# Altium schematic sheet Relays.SchDoc
size A3 portrait
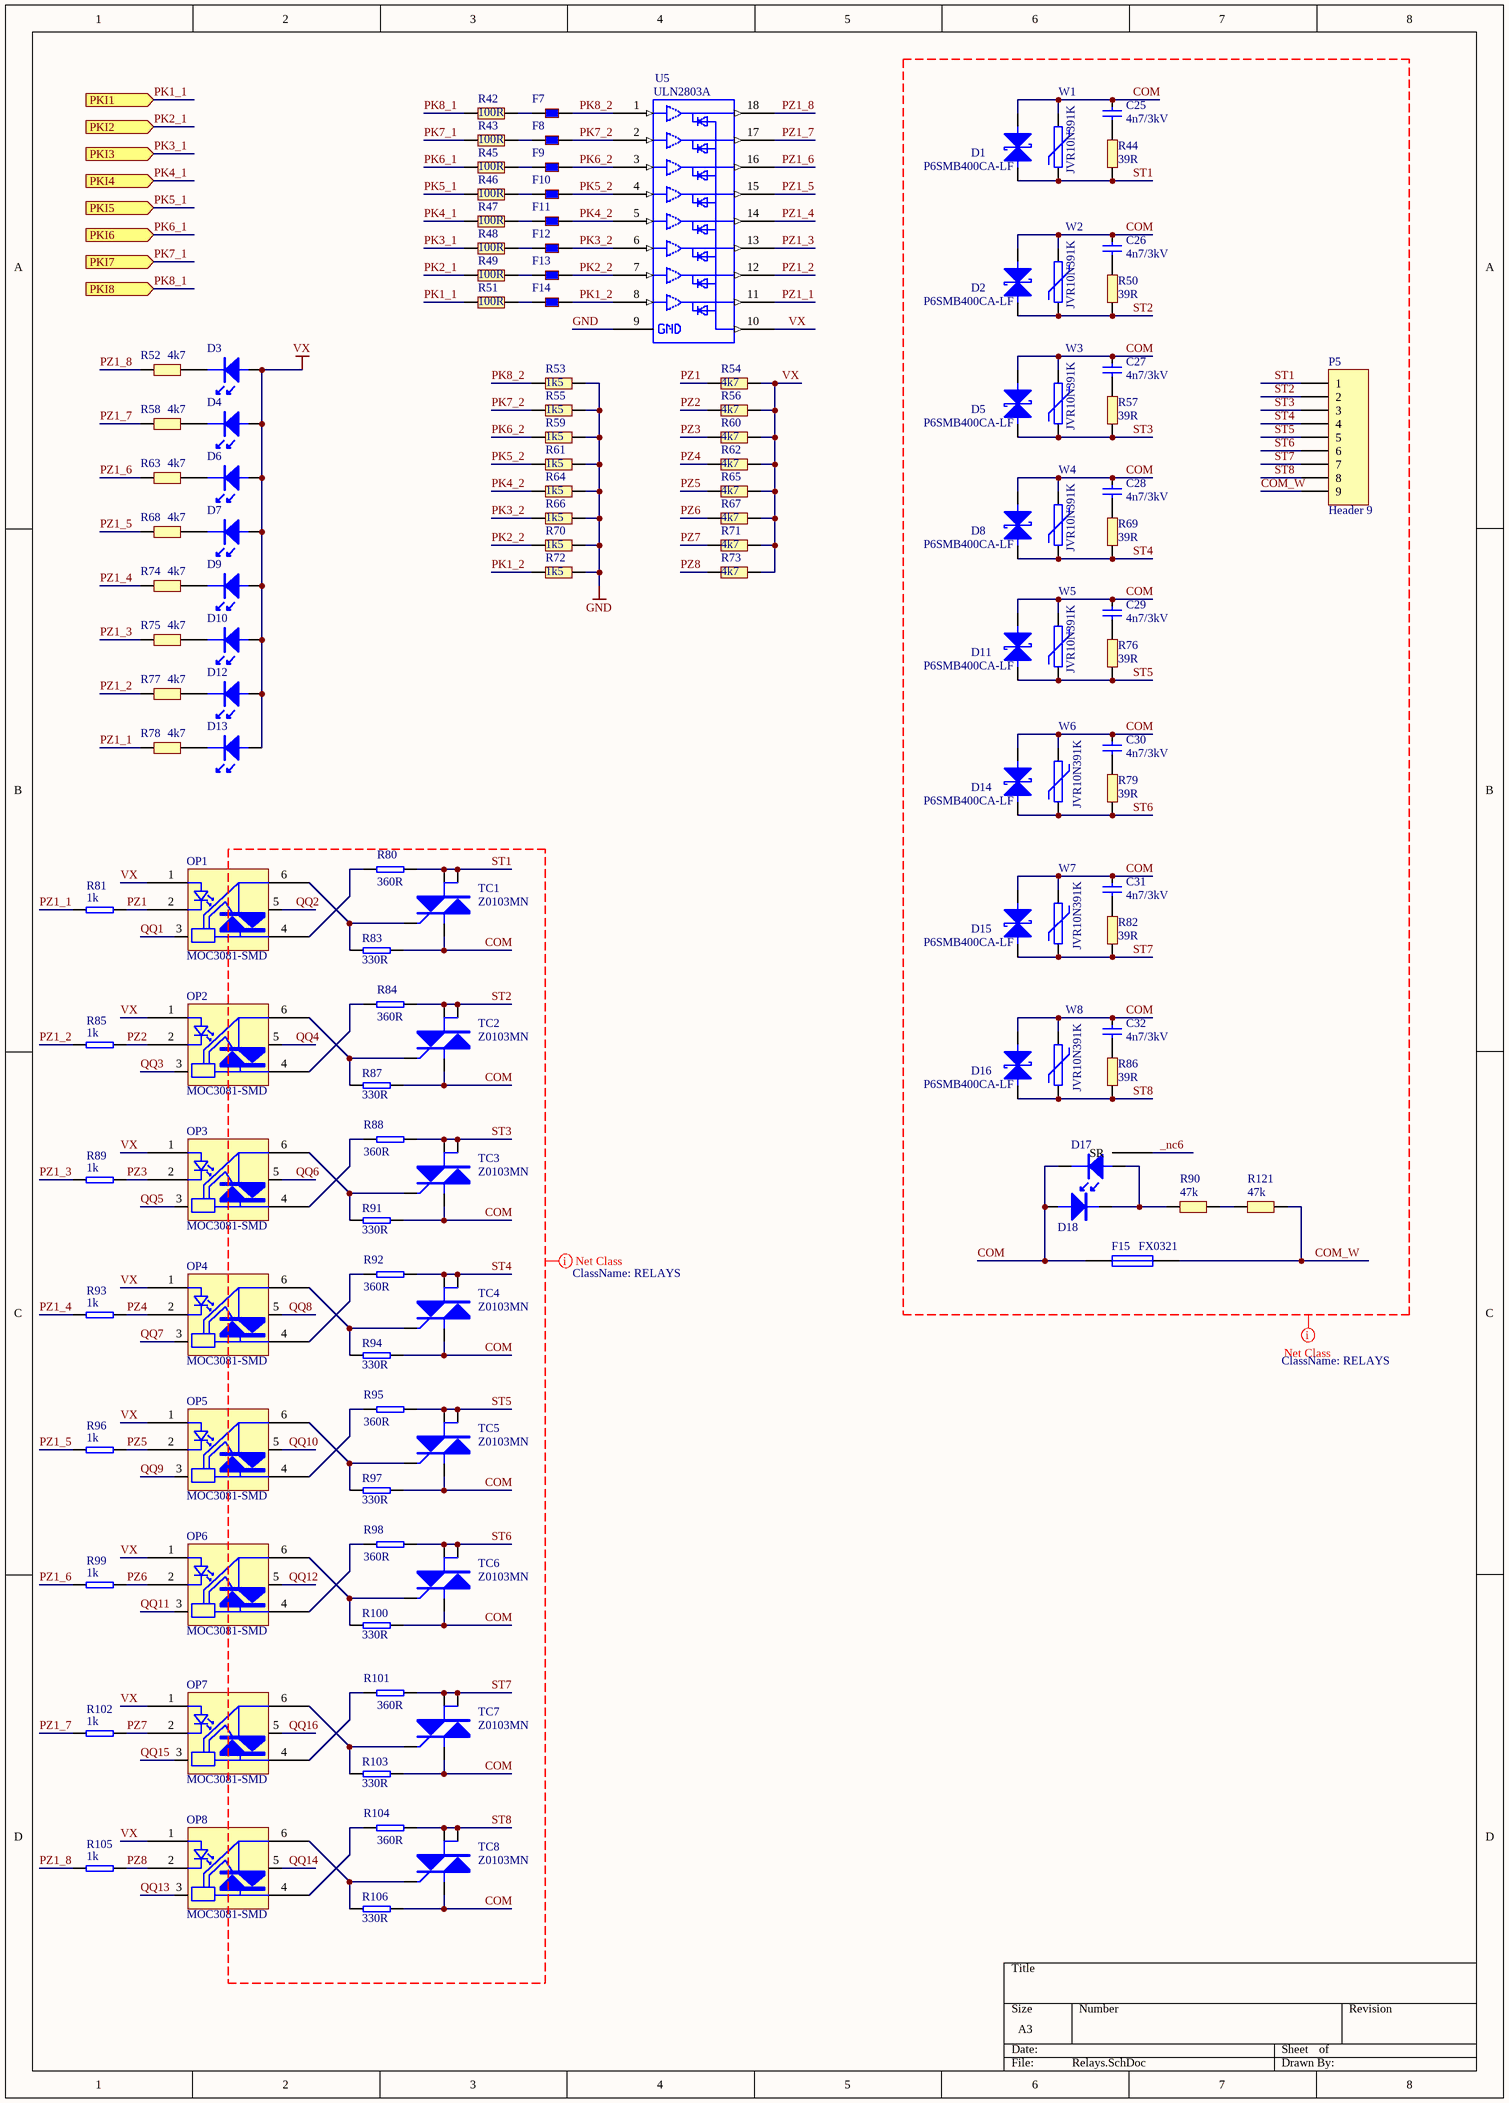
[diagram p0: Relays.SchDoc]

## Parts
C25  4n7/3kV  [CAP_75]
C26  4n7/3kV  [CAP_75]
C27  4n7/3kV  [CAP_75]
C28  4n7/3kV  [CAP_75]
C29  4n7/3kV  [CAP_75]
C30  4n7/3kV  [CAP_75]
C31  4n7/3kV  [CAP_75]
C32  4n7/3kV  [CAP_75]
D1  P6SMB400CA-LF  [RD5_U]
D2  P6SMB400CA-LF  [RD5_U]
D3  LED1  [0805LB]  (value not drawn)
D4  LED1  [0805LB]  (value not drawn)
D5  P6SMB400CA-LF  [RD5_U]
D6  LED1  [0805LB]  (value not drawn)
D7  LED1  [0805LB]  (value not drawn)
D8  P6SMB400CA-LF  [RD5_U]
D9  LED1  [0805LB]  (value not drawn)
D10  LED1  [0805LB]  (value not drawn)
D11  P6SMB400CA-LF  [RD5_U]
D12  LED1  [0805LB]  (value not drawn)
D13  LED1  [0805LB]  (value not drawn)
D14  P6SMB400CA-LF  [RD5_U]
D15  P6SMB400CA-LF  [RD5_U]
D16  P6SMB400CA-LF  [RD5_U]
D17  LED1  [LED_LAMP_1]  (value not drawn)
D18  1N4148-0805  [0805D]  (value not drawn)
F7  BLM18AG102SN1D  [0603L]  (value not drawn)
F8  BLM18AG102SN1D  [0603L]  (value not drawn)
F9  BLM18AG102SN1D  [0603L]  (value not drawn)
F10  BLM18AG102SN1D  [0603L]  (value not drawn)
F11  BLM18AG102SN1D  [0603L]  (value not drawn)
F12  BLM18AG102SN1D  [0603L]  (value not drawn)
F13  BLM18AG102SN1D  [0603L]  (value not drawn)
F14  BLM18AG102SN1D  [0603L]  (value not drawn)
F15  FX0321  [FX300]
OP1  MOC3081-SMD  [SMD6-OP]
OP2  MOC3081-SMD  [SMD6-OP]
OP3  MOC3081-SMD  [SMD6-OP]
OP4  MOC3081-SMD  [SMD6-OP]
OP5  MOC3081-SMD  [SMD6-OP]
OP6  MOC3081-SMD  [SMD6-OP]
OP7  MOC3081-SMD  [SMD6-OP]
OP8  MOC3081-SMD  [SMD6-OP]
P5  Header 9  [ARC-9-5.08]
R42  100R  [0603R]
R43  100R  [0603R]
R44  39R  [1206]
R45  100R  [0603R]
R46  100R  [0603R]
R47  100R  [0603R]
R48  100R  [0603R]
R49  100R  [0603R]
R50  39R  [1206]
R51  100R  [0603R]
R52  4k7  [0603R]
R53  1k5  [0603R]
R54  4k7  [0603R]
R55  1k5  [0603R]
R56  4k7  [0603R]
R57  39R  [1206]
R58  4k7  [0603R]
R59  1k5  [0603R]
R60  4k7  [0603R]
R61  1k5  [0603R]
R62  4k7  [0603R]
R63  4k7  [0603R]
R64  1k5  [0603R]
R65  4k7  [0603R]
R66  1k5  [0603R]
R67  4k7  [0603R]
R68  4k7  [0603R]
R69  39R  [1206]
R70  1k5  [0603R]
R71  4k7  [0603R]
R72  1k5  [0603R]
R73  4k7  [0603R]
R74  4k7  [0603R]
R75  4k7  [0603R]
R76  39R  [1206]
R77  4k7  [0603R]
R78  4k7  [0603R]
R79  39R  [1206]
R80  360R  [0805R]
R81  1k  [0603R]
R82  39R  [1206]
R83  330R  [0805R]
R84  360R  [0805R]
R85  1k  [0603R]
R86  39R  [1206]
R87  330R  [0805R]
R88  360R  [0805R]
R89  1k  [0603R]
R90  47k  [1206]
R91  330R  [0805R]
R92  360R  [0805R]
R93  1k  [0603R]
R94  330R  [0805R]
R95  360R  [0805R]
R96  1k  [0603R]
R97  330R  [0805R]
R98  360R  [0805R]
R99  1k  [0603R]
R100  330R  [0805R]
R101  360R  [0805R]
R102  1k  [0603R]
R103  330R  [0805R]
R104  360R  [0805R]
R105  1k  [0603R]
R106  330R  [0805R]
R121  47k  [1206]
TC1  Z0103MN  [SOT223]
TC2  Z0103MN  [SOT223]
TC3  Z0103MN  [SOT223]
TC4  Z0103MN  [SOT223]
TC5  Z0103MN  [SOT223]
TC6  Z0103MN  [SOT223]
TC7  Z0103MN  [SOT223]
TC8  Z0103MN  [SOT223]
U5  ULN2803A  [SO-18]
W1  JVR10N391K  [CAP_75]
W2  JVR10N391K  [CAP_75]
W3  JVR10N391K  [CAP_75]
W4  JVR10N391K  [CAP_75]
W5  JVR10N391K  [CAP_75]
W6  JVR10N391K  [CAP_75]
W7  JVR10N391K  [CAP_75]
W8  JVR10N391K  [CAP_75]

## Ports
PKI1 (in), PKI2 (in), PKI3 (in), PKI4 (in), PKI5 (in), PKI6 (in), PKI7 (in), PKI8 (in)

## Nets
GND: R53.1 R55.1 R59.1 R61.1 R64.1 R66.1 R70.1 R72.1 U5.9
VX: D3.A D4.A D6.A D7.A D9.A D10.A D12.A D13.A OP1.1 OP2.1 OP3.1 OP4.1 OP5.1 OP6.1 OP7.1 OP8.1 R54.1 R56.1 R60.1 R62.1 R65.1 R67.1 R71.1 R73.1 U5.10
_nc6: D17.0(SR)
COM: C25.2 C26.2 C27.2 C28.2 C29.2 C30.2 C31.2 C32.2 D1.K D2.K D5.K D8.K D11.K D14.K D15.K D16.K D17.K D18.A F15.1 R83.1 R87.1 R91.1 R94.1 R97.1 R100.1 R103.1 R106.1 TC1.1 TC2.1 TC3.1 TC4.1 TC5.1 TC6.1 TC7.1 TC8.1 W1.1 W2.1 W3.1 W4.1 W5.1 W6.1 W7.1 W8.1
COM_W: F15.2 P5.9 R121.1
PK1_1: R51.2 ; port PKI1
PK1_2: F14.2 R72.2 U5.8
PK2_1: R49.2 ; port PKI2
PK2_2: F13.2 R70.2 U5.7
PK3_1: R48.2 ; port PKI3
PK3_2: F12.2 R66.2 U5.6
PK4_1: R47.2 ; port PKI4
PK4_2: F11.2 R64.2 U5.5
PK5_1: R46.2 ; port PKI5
PK5_2: F10.2 R61.2 U5.4
PK6_1: R45.2 ; port PKI6
PK6_2: F9.2 R59.2 U5.3
PK7_1: R43.2 ; port PKI7
PK7_2: F8.2 R55.2 U5.2
PK8_1: R42.2 ; port PKI8
PK8_2: F7.2 R53.2 U5.1
PZ1: OP1.2 R54.2 R81.2
PZ1_1: R78.2 R81.1 U5.11
PZ1_2: R77.2 R85.1 U5.12
PZ1_3: R75.2 R89.1 U5.13
PZ1_4: R74.2 R93.1 U5.14
PZ1_5: R68.2 R96.1 U5.15
PZ1_6: R63.2 R99.1 U5.16
PZ1_7: R58.2 R102.1 U5.17
PZ1_8: R52.2 R105.1 U5.18
PZ2: OP2.2 R56.2 R85.2
PZ3: OP3.2 R60.2 R89.2
PZ4: OP4.2 R62.2 R93.2
PZ5: OP5.2 R65.2 R96.2
PZ6: OP6.2 R67.2 R99.2
PZ7: OP7.2 R71.2 R102.2
PZ8: OP8.2 R73.2 R105.2
QQ1: OP1.3
QQ2: OP1.5
QQ3: OP2.3
QQ4: OP2.5
QQ5: OP3.3
QQ6: OP3.5
QQ7: OP4.3
QQ8: OP4.5
QQ9: OP5.3
QQ10: OP5.5
QQ11: OP6.3
QQ12: OP6.5
QQ13: OP8.3
QQ14: OP8.5
QQ15: OP7.3
QQ16: OP7.5
ST1: D1.A P5.1 R44.1 R80.2 TC1.2 TC1.4 W1.2
ST2: D2.A P5.2 R50.1 R84.2 TC2.2 TC2.4 W2.2
ST3: D5.A P5.3 R57.1 R88.2 TC3.2 TC3.4 W3.2
ST4: D8.A P5.4 R69.1 R92.2 TC4.2 TC4.4 W4.2
ST5: D11.A P5.5 R76.1 R95.2 TC5.2 TC5.4 W5.2
ST6: D14.A P5.6 R79.1 R98.2 TC6.2 TC6.4 W6.2
ST7: D15.A P5.7 R82.1 R101.2 TC7.2 TC7.4 W7.2
ST8: D16.A P5.8 R86.1 R104.2 TC8.2 TC8.4 W8.2
NetC25_1: C25.1 R44.2
NetC26_1: C26.1 R50.2
NetC27_1: C27.1 R57.2
NetC28_1: C28.1 R69.2
NetC29_1: C29.1 R76.2
NetC30_1: C30.1 R79.2
NetC31_1: C31.1 R82.2
NetC32_1: C32.1 R86.2
NetD3_K: D3.K R52.1
NetD4_K: D4.K R58.1
NetD6_K: D6.K R63.1
NetD7_K: D7.K R68.1
NetD9_K: D9.K R74.1
NetD10_K: D10.K R75.1
NetD12_K: D12.K R77.1
NetD13_K: D13.K R78.1
NetD17_A: D17.A D18.K R90.2
NetF7_1: F7.1 R42.1
NetF8_1: F8.1 R43.1
NetF9_1: F9.1 R45.1
NetF10_1: F10.1 R46.1
NetF11_1: F11.1 R47.1
NetF12_1: F12.1 R48.1
NetF13_1: F13.1 R49.1
NetF14_1: F14.1 R51.1
NetOP1_4: OP1.4 R80.1
NetOP1_6: OP1.6 R83.2 TC1.3
NetOP2_4: OP2.4 R84.1
NetOP2_6: OP2.6 R87.2 TC2.3
NetOP3_4: OP3.4 R88.1
NetOP3_6: OP3.6 R91.2 TC3.3
NetOP4_4: OP4.4 R92.1
NetOP4_6: OP4.6 R94.2 TC4.3
NetOP5_4: OP5.4 R95.1
NetOP5_6: OP5.6 R97.2 TC5.3
NetOP6_4: OP6.4 R98.1
NetOP6_6: OP6.6 R100.2 TC6.3
NetOP7_4: OP7.4 R101.1
NetOP7_6: OP7.6 R103.2 TC7.3
NetOP8_4: OP8.4 R104.1
NetOP8_6: OP8.6 R106.2 TC8.3
NetR90_1: R90.1 R121.2

## Layout directives
net class RELAYS: _nc6, COM, COM_W, QQ2, QQ4, QQ6, QQ8, QQ10, QQ12, QQ14, QQ16, ST1, ST2, ST3, ST4, ST5, ST6, ST7, ST8

## Library data of the parts
C25-C32 = CAP
D1 D2 D5 D8 D11 D14-D16 = TRANSIL
D18 = DIODE1: Diode
F7-F14 = KORALIK: Koralik ferrytowy
F15 = FUSE1: Fuse
OP1-OP8 = MOC3041
P5 = Header 9: Header, 9-Pin; LatestRevisionDate: 17-Jul-2002; LatestRevisionNote: Re-released for DXP Platform.; Publisher: Altium Limited
R42-R106 R121 = RES3
U5 = Pro31.tmp_ULN2803A_42
W1-W8 = RES4